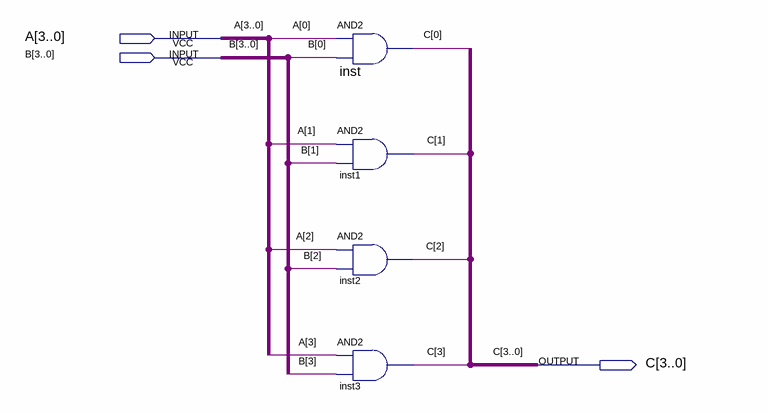
[diagram p0: schematic sheet]
// Quartus schematic and4.bdf as structural Verilog: 4 symbols, 3 pins
module and4 (
  input  [3:0] A,
  input  [3:0] B,
  output [3:0] C
);

  and inst (C[0], A[0], B[0]);
  and inst1 (C[1], A[1], B[1]);
  and inst2 (C[2], A[2], B[2]);
  and inst3 (C[3], A[3], B[3]);
endmodule
